# EAGLE design DebugPowerSupplyBoard (EAGLE 7.6.0)
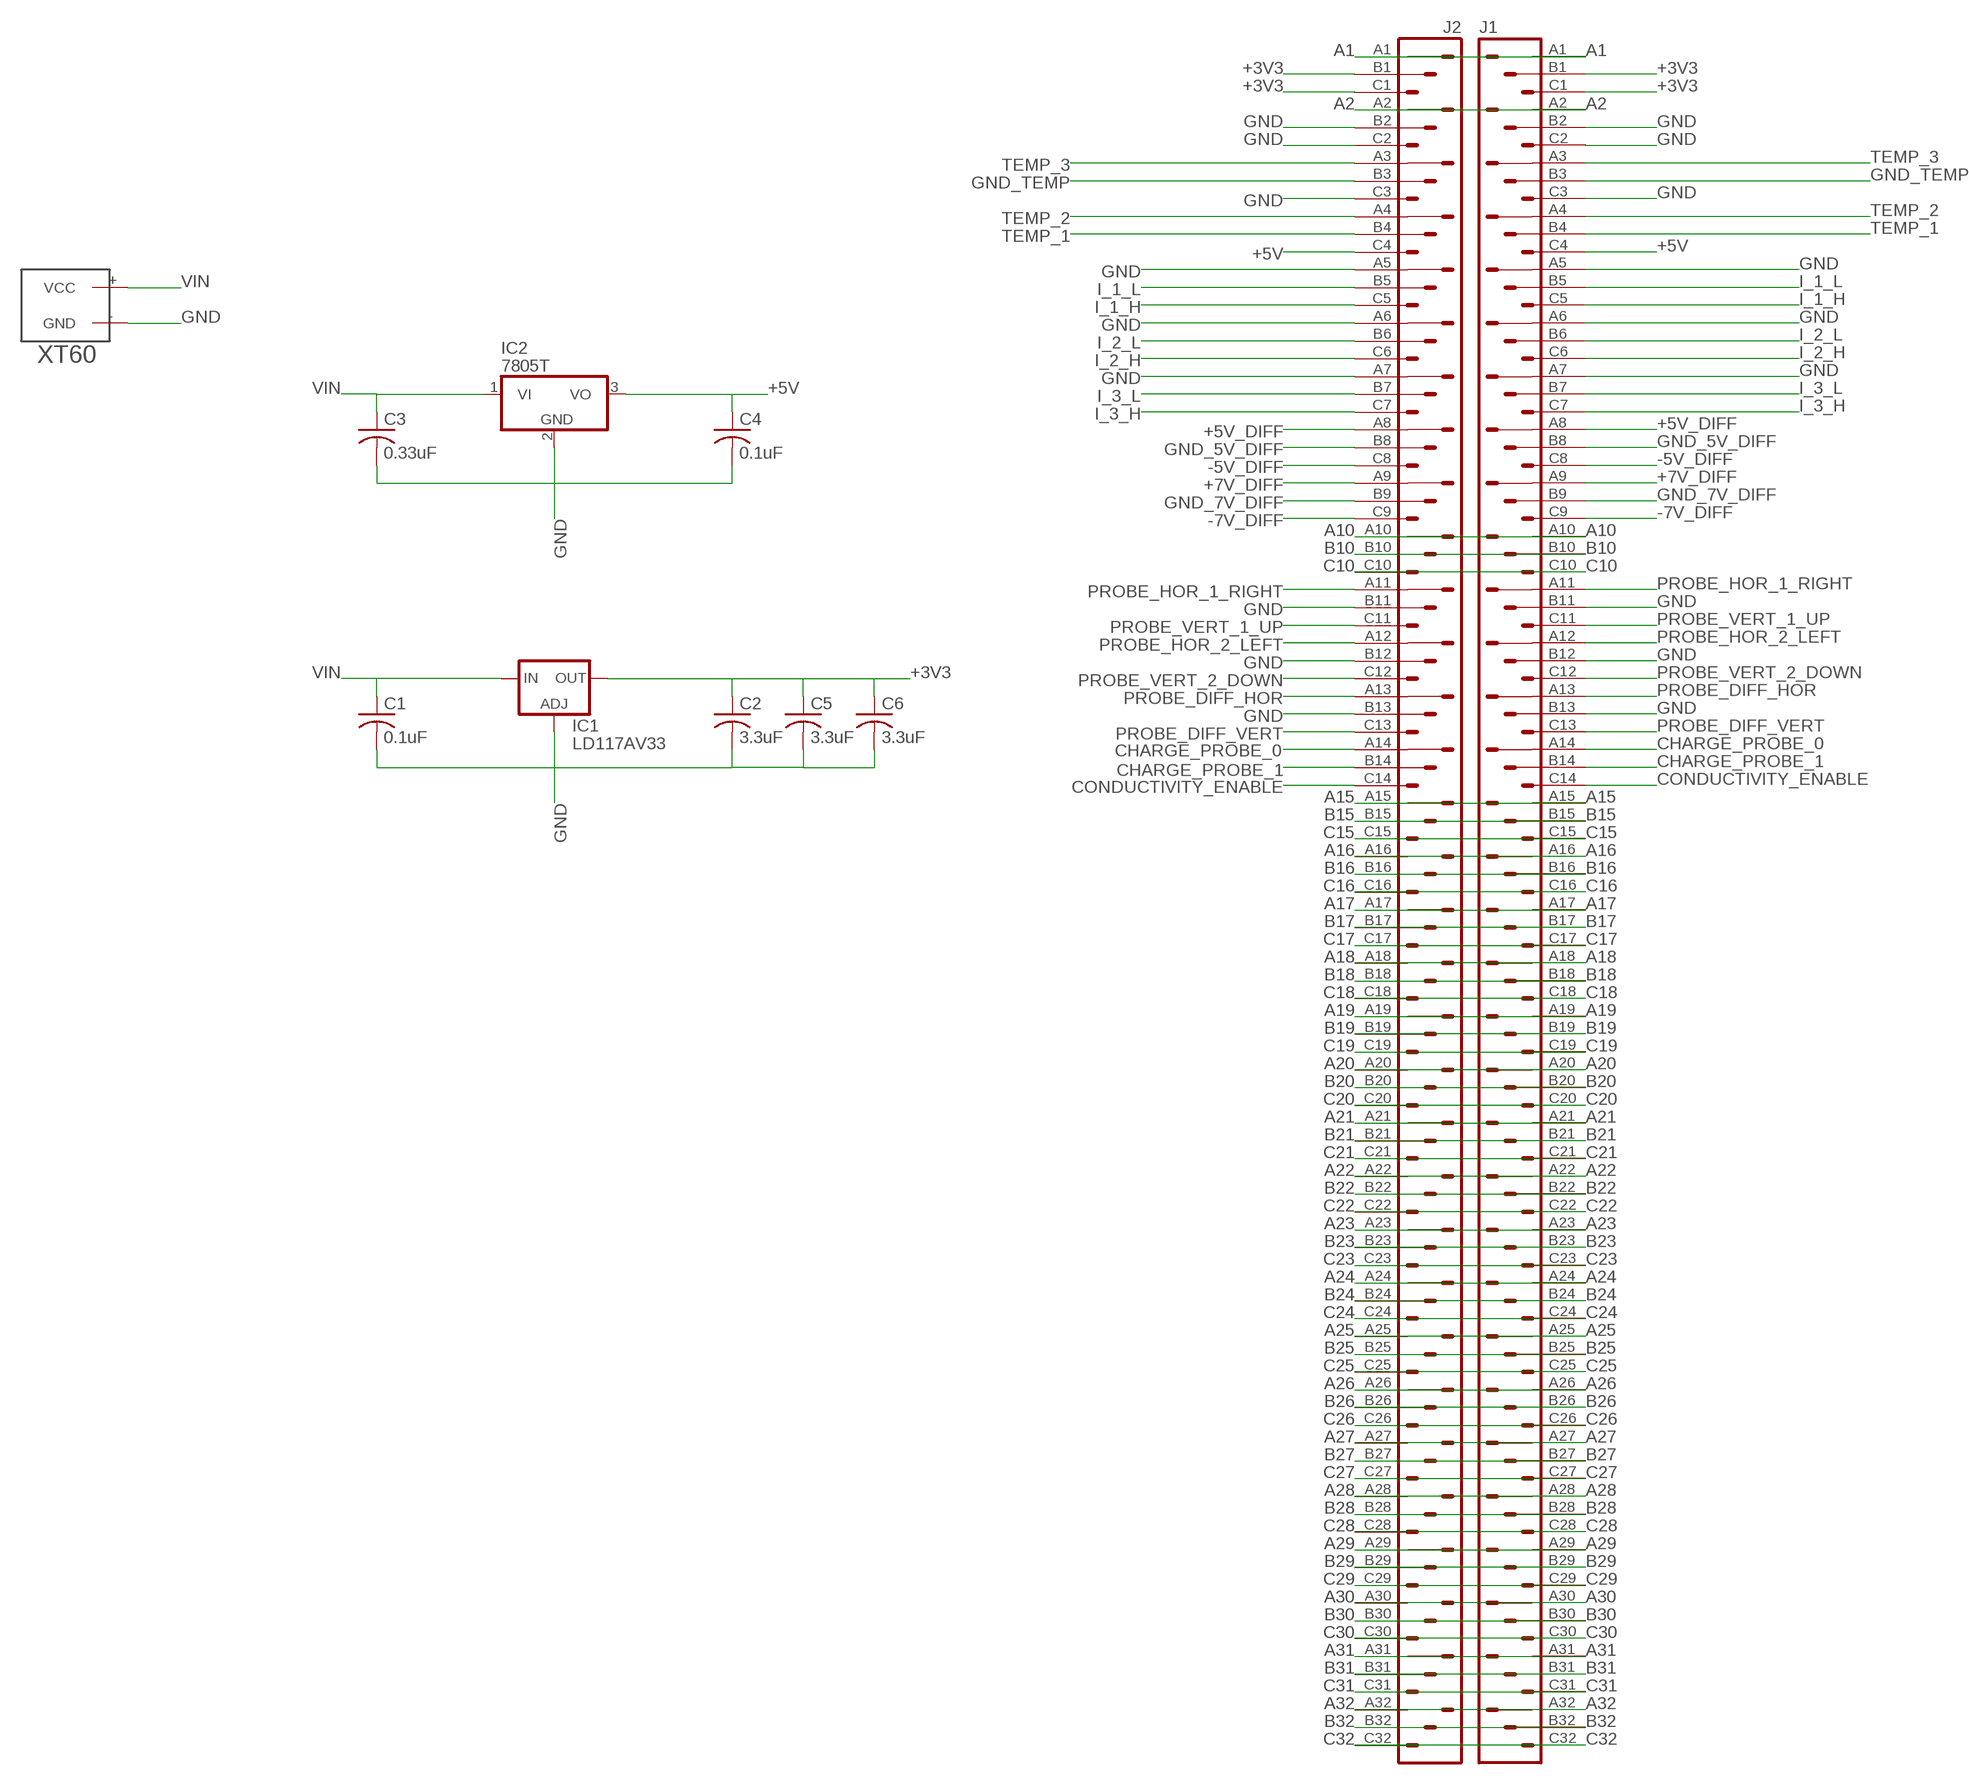
[diagram p0: schematic, sheet 1]

## Parts
C1  0.1uF  C-US050-025X075  [C050-025X075]
C2  3.3uF  C-US050-055X075  [C050-055X075]
C3  0.33uF  C-US050-035X075  [C050-035X075]
C4  0.1uF  C-US050-025X075  [C050-025X075]
C5  3.3uF  C-US050-055X075  [C050-055X075]
C6  3.3uF  C-US050-055X075  [C050-055X075]
IC1  LD117AV33  [TO220L1]
IC2  7805T  [TO220H]
J1  VG96KB  [VG96KB]
J2  VG96KB  [VG96KB]
U$6  XT60  [XT60]

## Nets
+3V3: C2.1 C5.1 C6.1 IC1.2(OUT) J1.B1 J1.C1 J2.B1 J2.C1
+5V [power]: C4.1 IC2.3(VO) J1.C4 J2.C4
+5V_DIFF: J1.A8 J2.A8
+7V_DIFF: J1.A9 J2.A9
-5V_DIFF: J1.C8 J2.C8
-7V_DIFF: J1.C9 J2.C9
A1: J1.A1 J2.A1
A2: J1.A2 J2.A2
A10: J1.A10 J2.A10
A15: J1.A15 J2.A15
A16: J1.A16 J2.A16
A17: J1.A17 J2.A17
A18: J1.A18 J2.A18
A19: J1.A19 J2.A19
A20: J1.A20 J2.A20
A21: J1.A21 J2.A21
A22: J1.A22 J2.A22
A23: J1.A23 J2.A23
A24: J1.A24 J2.A24
A25: J1.A25 J2.A25
A26: J1.A26 J2.A26
A27: J1.A27 J2.A27
A28: J1.A28 J2.A28
A29: J1.A29 J2.A29
A30: J1.A30 J2.A30
A31: J1.A31 J2.A31
A32: J1.A32 J2.A32
B10: J1.B10 J2.B10
B15: J1.B15 J2.B15
B16: J1.B16 J2.B16
B17: J1.B17 J2.B17
B18: J1.B18 J2.B18
B19: J1.B19 J2.B19
B20: J1.B20 J2.B20
B21: J1.B21 J2.B21
B22: J1.B22 J2.B22
B23: J1.B23 J2.B23
B24: J1.B24 J2.B24
B25: J1.B25 J2.B25
B26: J1.B26 J2.B26
B27: J1.B27 J2.B27
B28: J1.B28 J2.B28
B29: J1.B29 J2.B29
B30: J1.B30 J2.B30
B31: J1.B31 J2.B31
B32: J1.B32 J2.B32
C10: J1.C10 J2.C10
C15: J1.C15 J2.C15
C16: J1.C16 J2.C16
C17: J1.C17 J2.C17
C18: J1.C18 J2.C18
C19: J1.C19 J2.C19
C20: J1.C20 J2.C20
C21: J1.C21 J2.C21
C22: J1.C22 J2.C22
C23: J1.C23 J2.C23
C24: J1.C24 J2.C24
C25: J1.C25 J2.C25
C26: J1.C26 J2.C26
C27: J1.C27 J2.C27
C28: J1.C28 J2.C28
C29: J1.C29 J2.C29
C30: J1.C30 J2.C30
C31: J1.C31 J2.C31
C32: J1.C32 J2.C32
CHARGE_PROBE_0: J1.A14 J2.A14
CHARGE_PROBE_1: J1.B14 J2.B14
CONDUCTIVITY_ENABLE: J1.C14 J2.C14
GND [power]: C1.2 C2.2 C3.2 C4.2 C5.2 C6.2 IC1.1(ADJ) IC2.2(GND) J1.A5 J1.A6 J1.A7 J1.B2 J1.B11 J1.B12 J1.B13 J1.C2 J1.C3 J2.A5 J2.A6 J2.A7 J2.B2 J2.B11 J2.B12 J2.B13 J2.C2 J2.C3 U$6.-(GND)
GND_5V_DIFF: J1.B8 J2.B8
GND_7V_DIFF: J1.B9 J2.B9
GND_TEMP: J1.B3 J2.B3
I_1_H: J1.C5 J2.C5
I_1_L: J1.B5 J2.B5
I_2_H: J1.C6 J2.C6
I_2_L: J1.B6 J2.B6
I_3_H: J1.C7 J2.C7
I_3_L: J1.B7 J2.B7
PROBE_DIFF_HOR: J1.A13 J2.A13
PROBE_DIFF_VERT: J1.C13 J2.C13
PROBE_HOR_1_RIGHT: J1.A11 J2.A11
PROBE_HOR_2_LEFT: J1.A12 J2.A12
PROBE_VERT_1_UP: J1.C11 J2.C11
PROBE_VERT_2_DOWN: J1.C12 J2.C12
TEMP_1: J1.B4 J2.B4
TEMP_2: J1.A4 J2.A4
TEMP_3: J1.A3 J2.A3
VIN: C1.1 C3.1 IC1.3(IN) IC2.1(VI) U$6.+(VCC)

## Library data of the parts
C1-C6 = rcl:C-US: CAPACITOR, American symbol
IC1 = v-reg:LD117A?*: Low drop fixed and adjustable positive voltage regulators 1 A Source: http://www.st.com/stonline/products/literature/ds/7194/ld1117axx.pdf
IC2 = linear:78*: Positive VOLTAGE REGULATOR Source: http://cache.national.com/ds/LM/LM78L05.pdf http://www.fairchildsemi.com/ds/LM/LM7805.pdf
J1 = CustomEuroCard:VG96: PCB EUROCARD, 96-pin type C/ABC, 2.54 mm
J2 = 19inch_VG96KB:VG96: PCB EUROCARD, 96-pin type C/ABC, 2.54 mm
U$6 = XT60:XT60: XT60

## Net classes
0 default: width 0.203 mm, drill 0.33 mm, clearance 0.152 mm
1 power: width 0.406 mm, drill 0.33 mm, clearance 0.152 mm

## Board
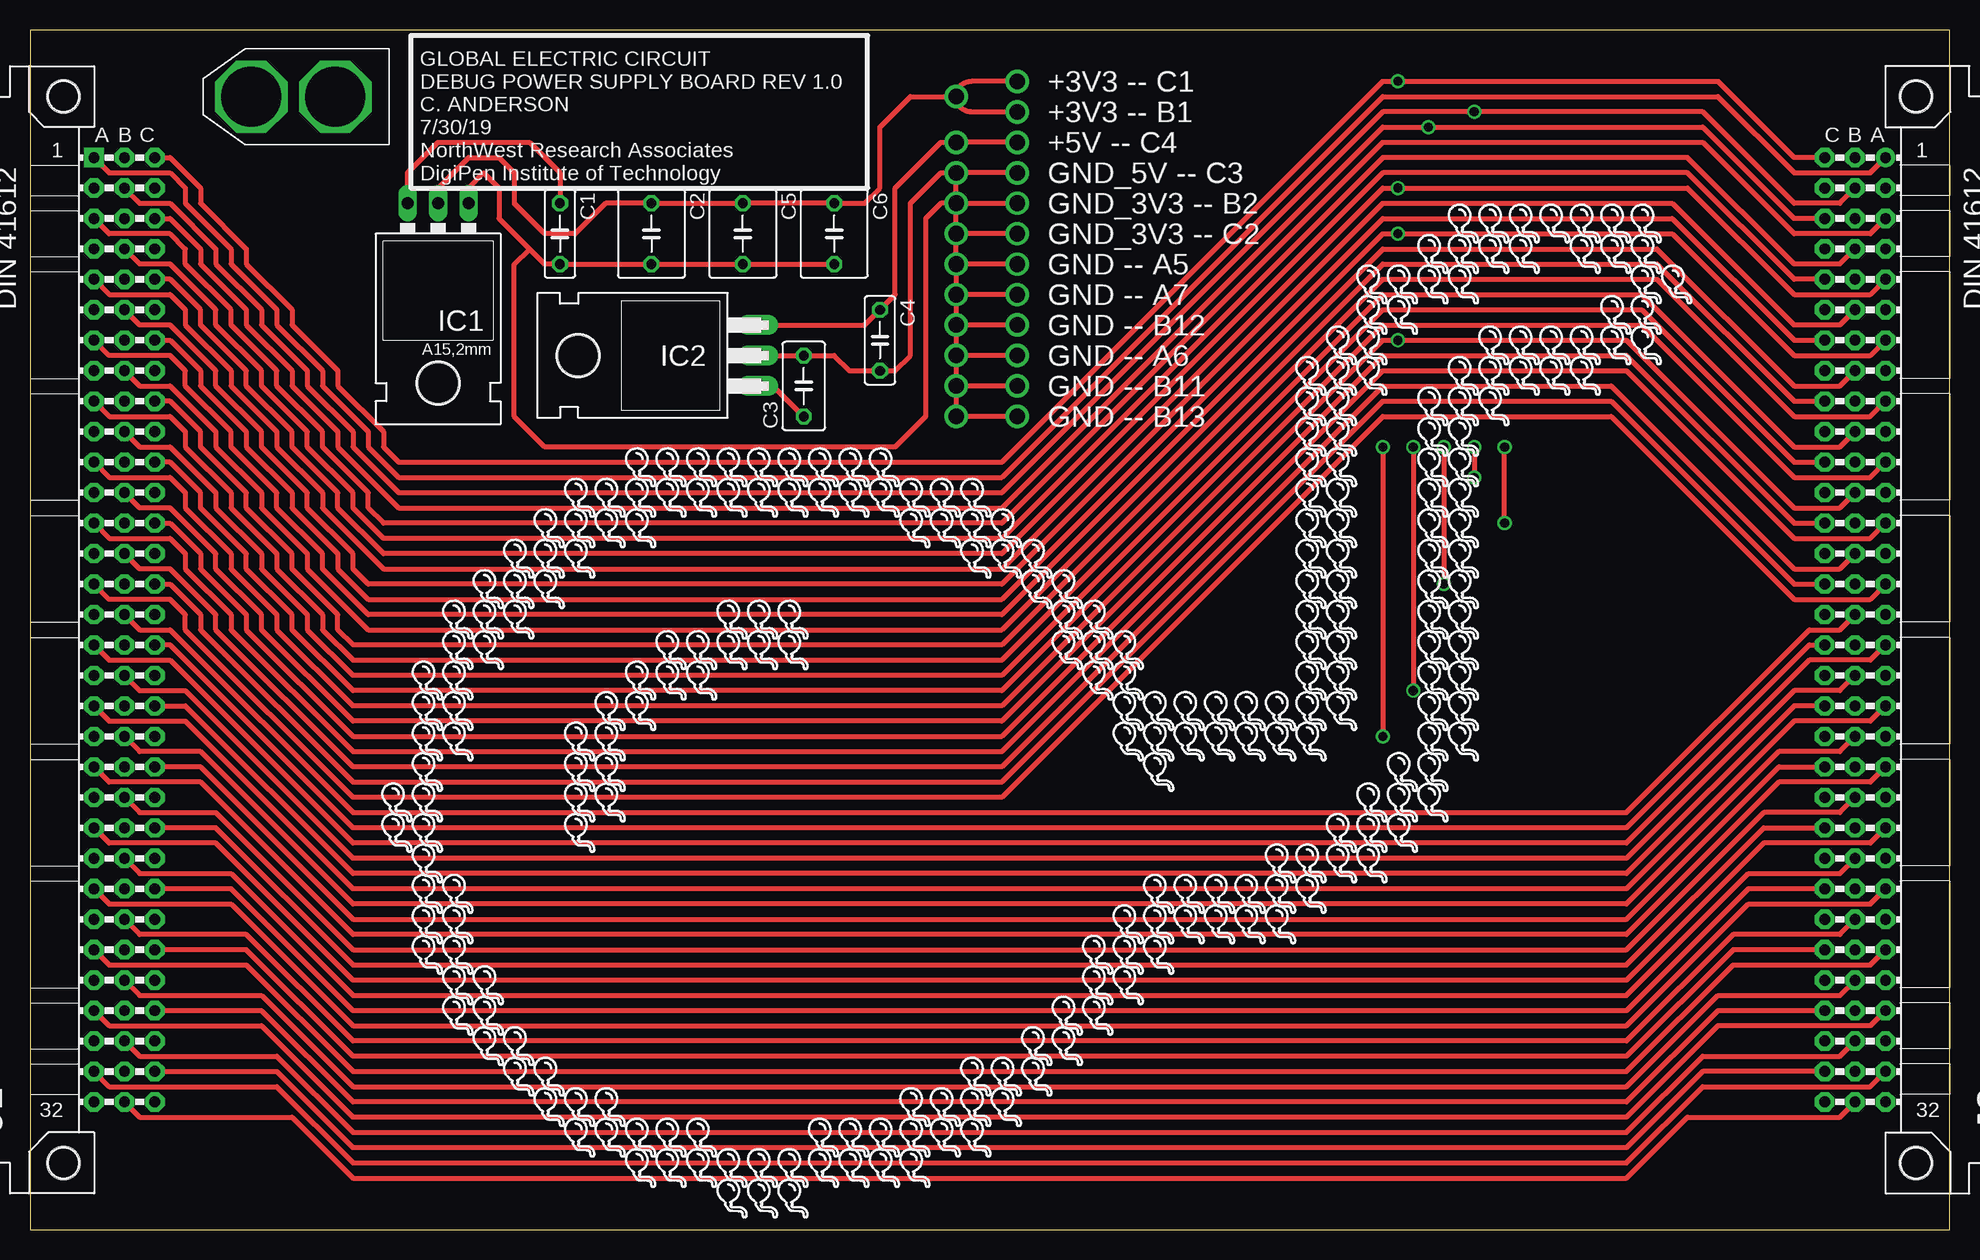
[diagram p1: board, top side]
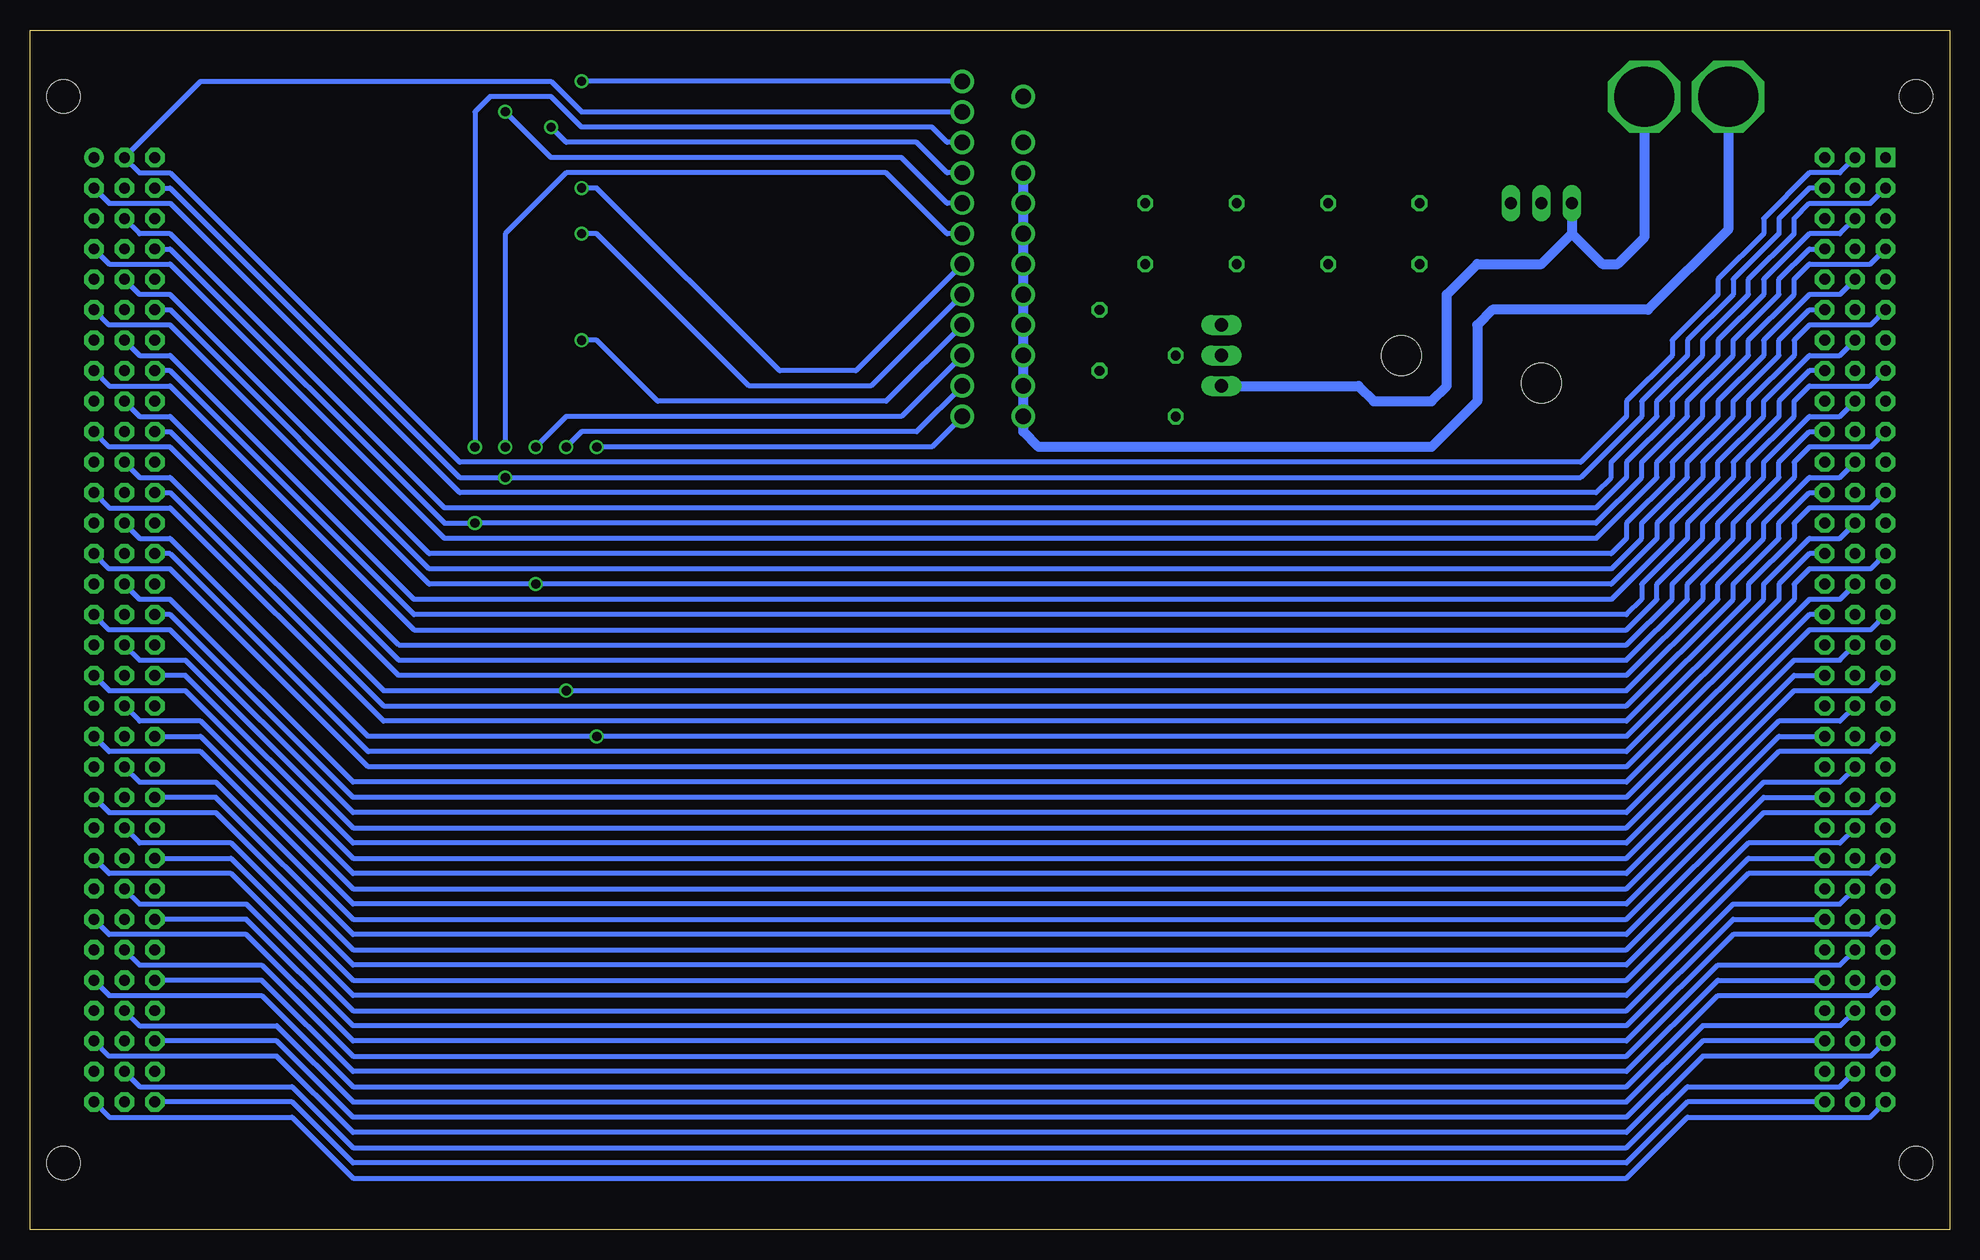
[diagram p2: board, bottom side, seen from below]

Size 160 x 100 mm. Coordinates in mm from the lower left corner, seen from the top.
Copper layers (1*16): Top 0.035mm / dielectric 1.5mm / Bottom 0.035mm
Design rules "default *": minimum track width 6mil, minimum drill 0.3mm, track to track 6mil, track to pad 6mil, pad to pad 6mil, via to via 6mil, smd to smd 6mil, copper to edge 40mil, drill to drill 6mil, minimum pad ring 10mil, minimum via ring 8mil, stop-mask expansion 6mil, vias tented up to drill 0mil, thermal gap 10mil

### Footprints (pad centres in the part's own frame; a part is rotated, then mirrored left to right if it is on the bottom)
C050-025X075 = drill 0.813 octagon: 1 -2.54,0; 2 2.54,0
C050-055X075 = drill 0.813 octagon: 1 -2.54,0; 2 2.54,0
C050-035X075 = drill 0.813 octagon: 1 -2.54,0; 2 2.54,0
TO220L1 = drill 1.016 long: 1 -2.54,-3.81; 2 0,-3.81; 3 2.54,-3.81 | hole 3.302: 0,11.176
TO220H = drill 1.118 long: 1 -2.54,-10.16; 2 0,-10.16; 3 2.54,-10.16 | hole 3.302: 0,4.826
VG96KB = drill 0.914 pad 1.6 square: A1 5.334,39.37 | drill 0.914 pad 1.6 octagon: A2 5.334,36.83; A3 5.334,34.29; A4 5.334,31.75; A5 5.334,29.21; A6 5.334,26.67; A7 5.334,24.13; A8 5.334,21.59; A9 5.334,19.05; A10 5.334,16.51; A11 5.334,13.97; A12 5.334,11.43; A13 5.334,8.89; A14 5.334,6.35; A15 5.334,3.81; A16 5.334,1.27; A17 5.334,-1.27; A18 5.334,-3.81; A19 5.334,-6.35; A20 5.334,-8.89; A21 5.334,-11.43; A22 5.334,-13.97; A23 5.334,-16.51; A24 5.334,-19.05; A25 5.334,-21.59; A26 5.334,-24.13; A27 5.334,-26.67; A28 5.334,-29.21; A29 5.334,-31.75; A30 5.334,-34.29; A31 5.334,-36.83; A32 5.334,-39.37; B1 7.874,39.37; B2 7.874,36.83; B3 7.874,34.29; B4 7.874,31.75; B5 7.874,29.21; B6 7.874,26.67; B7 7.874,24.13; B8 7.874,21.59; B9 7.874,19.05; B10 7.874,16.51; B11 7.874,13.97; B12 7.874,11.43; B13 7.874,8.89; B14 7.874,6.35; B15 7.874,3.81; B16 7.874,1.27; B17 7.874,-1.27; B18 7.874,-3.81; B19 7.874,-6.35; B20 7.874,-8.89; B21 7.874,-11.43; B22 7.874,-13.97; B23 7.874,-16.51; B24 7.874,-19.05; B25 7.874,-21.59; B26 7.874,-24.13; B27 7.874,-26.67; B28 7.874,-29.21; B29 7.874,-31.75; B30 7.874,-34.29; B31 7.874,-36.83; B32 7.874,-39.37; C1 10.414,39.37; C2 10.414,36.83; C3 10.414,34.29; C4 10.414,31.75; C5 10.414,29.21; C6 10.414,26.67; C7 10.414,24.13; C8 10.414,21.59; C9 10.414,19.05; C10 10.414,16.51; C11 10.414,13.97; C12 10.414,11.43; C13 10.414,8.89; C14 10.414,6.35; C15 10.414,3.81; C16 10.414,1.27; C17 10.414,-1.27; C18 10.414,-3.81; C19 10.414,-6.35; C20 10.414,-8.89; C21 10.414,-11.43; C22 10.414,-13.97; C23 10.414,-16.51; C24 10.414,-19.05; C25 10.414,-21.59; C26 10.414,-24.13; C27 10.414,-26.67; C28 10.414,-29.21; C29 10.414,-31.75; C30 10.414,-34.29; C31 10.414,-36.83; C32 10.414,-39.37 | hole 2.794: 2.794,44.45; 2.794,-44.45
VG96KB' = drill 0.914 pad 1.6: A1 154.666,39.37 | drill 0.914 pad 1.6 octagon: A2 154.666,36.83; A3 154.666,34.29; A4 154.666,31.75; A5 154.666,29.21; A6 154.666,26.67; A7 154.666,24.13; A8 154.666,21.59; A9 154.666,19.05; A10 154.666,16.51; A11 154.666,13.97; A12 154.666,11.43; A13 154.666,8.89; A14 154.666,6.35; A15 154.666,3.81; A16 154.666,1.27; A17 154.666,-1.27; A18 154.666,-3.81; A19 154.666,-6.35; A20 154.666,-8.89; A21 154.666,-11.43; A22 154.666,-13.97; A23 154.666,-16.51; A24 154.666,-19.05; A25 154.666,-21.59; A26 154.666,-24.13; A27 154.666,-26.67; A28 154.666,-29.21; A29 154.666,-31.75; A30 154.666,-34.29; A31 154.666,-36.83; A32 154.666,-39.37; B1 152.126,39.37; B2 152.126,36.83; B3 152.126,34.29; B4 152.126,31.75; B5 152.126,29.21; B6 152.126,26.67; B7 152.126,24.13; B8 152.126,21.59; B9 152.126,19.05; B10 152.126,16.51; B11 152.126,13.97; B12 152.126,11.43; B13 152.126,8.89; B14 152.126,6.35; B15 152.126,3.81; B16 152.126,1.27; B17 152.126,-1.27; B18 152.126,-3.81; B19 152.126,-6.35; B20 152.126,-8.89; B21 152.126,-11.43; B22 152.126,-13.97; B23 152.126,-16.51; B24 152.126,-19.05; B25 152.126,-21.59; B26 152.126,-24.13; B27 152.126,-26.67; B28 152.126,-29.21; B29 152.126,-31.75; B30 152.126,-34.29; B31 152.126,-36.83; B32 152.126,-39.37; C1 149.586,39.37; C2 149.586,36.83; C3 149.586,34.29; C4 149.586,31.75; C5 149.586,29.21; C6 149.586,26.67; C7 149.586,24.13; C8 149.586,21.59; C9 149.586,19.05; C10 149.586,16.51; C11 149.586,13.97; C12 149.586,11.43; C13 149.586,8.89; C14 149.586,6.35; C15 149.586,3.81; C16 149.586,1.27; C17 149.586,-1.27; C18 149.586,-3.81; C19 149.586,-6.35; C20 149.586,-8.89; C21 149.586,-11.43; C22 149.586,-13.97; C23 149.586,-16.51; C24 149.586,-19.05; C25 149.586,-21.59; C26 149.586,-24.13; C27 149.586,-26.67; C28 149.586,-29.21; C29 149.586,-31.75; C30 149.586,-34.29; C31 149.586,-36.83; C32 149.586,-39.37 | hole 2.794: 157.206,44.45; 157.206,-44.45
XT60 = drill 5 octagon: + 4.5,0; - 11.5,0

### Placement (x,y rotation side)
C1  44.18,83.02 270 top
C2  51.8,83.02 270 top
C3  64.5,70.32 90 top
C4  70.85,74.13 270 top
C5  59.42,83.02 270 top
C6  67.04,83.02 270 top
IC1  34.02,81.75 180 top
IC2  50.53,72.86 90 top
J1  0,50 0 top
J2  [VG96KB']  0,50 0 top
U$6  29.95,94.45 180 top
U$21  [BALLOON]  58.15,3.01 0 top
U$273  [BALLOON]  60.69,3.01 0 top
U$274  [BALLOON]  63.23,3.01 0 top
U$275  [BALLOON]  58.15,5.55 0 top
U$276  [BALLOON]  55.61,5.55 0 top
U$277  [BALLOON]  53.07,5.55 0 top
U$278  [BALLOON]  50.53,5.55 0 top
U$279  [BALLOON]  60.69,5.55 0 top
U$280  [BALLOON]  63.23,5.55 0 top
U$281  [BALLOON]  65.77,5.55 0 top
U$282  [BALLOON]  68.31,5.55 0 top
U$283  [BALLOON]  70.85,5.55 0 top
U$284  [BALLOON]  55.61,8.09 0 top
U$285  [BALLOON]  53.07,8.09 0 top
U$286  [BALLOON]  50.53,8.09 0 top
U$287  [BALLOON]  47.99,8.09 0 top
U$288  [BALLOON]  45.45,8.09 0 top
U$289  [BALLOON]  70.85,8.09 0 top
U$290  [BALLOON]  73.39,8.09 0 top
U$291  [BALLOON]  75.93,8.09 0 top
U$292  [BALLOON]  68.31,8.09 0 top
U$293  [BALLOON]  65.77,8.09 0 top
U$294  [BALLOON]  78.47,8.09 0 top
U$295  [BALLOON]  73.39,5.55 0 top
U$296  [BALLOON]  78.47,10.63 0 top
U$297  [BALLOON]  75.93,10.63 0 top
U$298  [BALLOON]  42.91,10.63 0 top
U$299  [BALLOON]  40.37,13.17 0 top
U$300  [BALLOON]  45.45,10.63 0 top
U$301  [BALLOON]  47.99,10.63 0 top
U$302  [BALLOON]  42.91,13.17 0 top
U$303  [BALLOON]  37.83,15.71 0 top
U$304  [BALLOON]  40.37,15.71 0 top
U$305  [BALLOON]  35.29,18.25 0 top
U$306  [BALLOON]  35.29,20.79 0 top
U$307  [BALLOON]  37.83,18.25 0 top
U$308  [BALLOON]  37.83,20.79 0 top
U$309  [BALLOON]  32.75,23.33 0 top
U$310  [BALLOON]  32.75,25.87 0 top
U$311  [BALLOON]  32.75,28.41 0 top
U$312  [BALLOON]  35.29,28.41 0 top
U$313  [BALLOON]  35.29,25.87 0 top
U$314  [BALLOON]  35.29,23.33 0 top
U$315  [BALLOON]  32.75,30.95 0 top
U$316  [BALLOON]  32.75,33.49 0 top
U$317  [BALLOON]  30.21,33.49 0 top
U$318  [BALLOON]  30.21,36.03 0 top
U$319  [BALLOON]  32.75,36.03 0 top
U$320  [BALLOON]  32.75,38.57 0 top
U$321  [BALLOON]  45.45,33.49 0 top
U$322  [BALLOON]  45.45,36.03 0 top
U$323  [BALLOON]  47.99,36.03 0 top
U$324  [BALLOON]  45.45,38.57 0 top
U$325  [BALLOON]  45.45,41.11 0 top
U$326  [BALLOON]  47.99,38.57 0 top
U$327  [BALLOON]  47.99,41.11 0 top
U$328  [BALLOON]  47.99,43.65 0 top
U$329  [BALLOON]  50.53,43.65 0 top
U$330  [BALLOON]  50.53,46.19 0 top
U$331  [BALLOON]  53.07,46.19 0 top
U$332  [BALLOON]  55.61,46.19 0 top
U$333  [BALLOON]  53.07,48.73 0 top
U$334  [BALLOON]  55.61,48.73 0 top
U$335  [BALLOON]  58.15,48.73 0 top
U$336  [BALLOON]  60.69,48.73 0 top
U$337  [BALLOON]  63.23,48.73 0 top
U$338  [BALLOON]  63.23,51.27 0 top
U$339  [BALLOON]  60.69,51.27 0 top
U$340  [BALLOON]  58.15,51.27 0 top
U$341  [BALLOON]  32.75,41.11 0 top
U$342  [BALLOON]  35.29,41.11 0 top
U$343  [BALLOON]  35.29,43.65 0 top
U$344  [BALLOON]  35.29,46.19 0 top
U$345  [BALLOON]  32.75,46.19 0 top
U$346  [BALLOON]  32.75,43.65 0 top
U$347  [BALLOON]  35.29,48.73 0 top
U$348  [BALLOON]  35.29,51.27 0 top
U$349  [BALLOON]  37.83,48.73 0 top
U$350  [BALLOON]  37.83,51.27 0 top
U$351  [BALLOON]  37.83,53.81 0 top
U$352  [BALLOON]  40.37,56.35 0 top
U$353  [BALLOON]  42.91,58.89 0 top
U$354  [BALLOON]  45.45,61.43 0 top
U$355  [BALLOON]  47.99,61.43 0 top
U$356  [BALLOON]  45.45,58.89 0 top
U$357  [BALLOON]  42.91,56.35 0 top
U$358  [BALLOON]  40.37,53.81 0 top
U$359  [BALLOON]  40.37,51.27 0 top
U$360  [BALLOON]  42.91,53.81 0 top
U$361  [BALLOON]  45.45,56.35 0 top
U$362  [BALLOON]  47.99,58.89 0 top
U$363  [BALLOON]  50.53,61.43 0 top
U$364  [BALLOON]  50.53,58.89 0 top
U$365  [BALLOON]  50.53,63.97 0 top
U$366  [BALLOON]  53.07,61.43 0 top
U$367  [BALLOON]  53.07,63.97 0 top
U$368  [BALLOON]  55.61,61.43 0 top
U$369  [BALLOON]  58.15,61.43 0 top
U$370  [BALLOON]  60.69,61.43 0 top
U$371  [BALLOON]  63.23,61.43 0 top
U$372  [BALLOON]  60.69,61.43 0 top
U$373  [BALLOON]  65.77,61.43 0 top
U$374  [BALLOON]  68.31,61.43 0 top
U$375  [BALLOON]  70.85,61.43 0 top
U$376  [BALLOON]  55.61,63.97 0 top
U$377  [BALLOON]  58.15,63.97 0 top
U$378  [BALLOON]  60.69,63.97 0 top
U$379  [BALLOON]  63.23,63.97 0 top
U$380  [BALLOON]  65.77,63.97 0 top
U$381  [BALLOON]  68.31,63.97 0 top
U$382  [BALLOON]  70.85,63.97 0 top
U$383  [BALLOON]  73.39,61.43 0 top
U$384  [BALLOON]  73.39,58.89 0 top
U$385  [BALLOON]  75.93,58.89 0 top
U$386  [BALLOON]  78.47,58.89 0 top
U$387  [BALLOON]  78.47,61.43 0 top
U$388  [BALLOON]  75.93,61.43 0 top
U$389  [BALLOON]  78.47,56.35 0 top
U$390  [BALLOON]  81.01,56.35 0 top
U$391  [BALLOON]  81.01,58.89 0 top
U$392  [BALLOON]  83.55,56.35 0 top
U$393  [BALLOON]  83.55,53.81 0 top
U$394  [BALLOON]  86.09,53.81 0 top
U$395  [BALLOON]  86.09,51.27 0 top
U$396  [BALLOON]  86.09,48.73 0 top
U$397  [BALLOON]  88.63,51.27 0 top
U$398  [BALLOON]  88.63,48.73 0 top
U$399  [BALLOON]  88.63,46.19 0 top
U$400  [BALLOON]  91.17,48.73 0 top
U$401  [BALLOON]  91.17,46.19 0 top
U$402  [BALLOON]  91.17,43.65 0 top
U$403  [BALLOON]  91.17,41.11 0 top
U$404  [BALLOON]  93.71,38.57 0 top
U$405  [BALLOON]  93.71,41.11 0 top
U$406  [BALLOON]  93.71,43.65 0 top
U$407  [BALLOON]  96.25,41.11 0 top
U$408  [BALLOON]  98.79,41.11 0 top
U$409  [BALLOON]  101.33,41.11 0 top
U$410  [BALLOON]  103.87,41.11 0 top
U$411  [BALLOON]  106.41,41.11 0 top
U$412  [BALLOON]  106.41,43.65 0 top
U$413  [BALLOON]  103.87,43.65 0 top
U$414  [BALLOON]  101.33,43.65 0 top
U$415  [BALLOON]  98.79,43.65 0 top
U$416  [BALLOON]  96.25,43.65 0 top
U$417  [BALLOON]  108.95,43.65 0 top
U$418  [BALLOON]  108.95,46.19 0 top
U$419  [BALLOON]  108.95,48.73 0 top
U$420  [BALLOON]  108.95,51.27 0 top
U$421  [BALLOON]  108.95,53.81 0 top
U$422  [BALLOON]  108.95,56.35 0 top
U$423  [BALLOON]  108.95,58.89 0 top
U$424  [BALLOON]  108.95,61.43 0 top
U$425  [BALLOON]  108.95,63.97 0 top
U$426  [BALLOON]  108.95,66.51 0 top
U$427  [BALLOON]  108.95,69.05 0 top
U$428  [BALLOON]  108.95,71.59 0 top
U$429  [BALLOON]  106.41,71.59 0 top
U$430  [BALLOON]  106.41,69.05 0 top
U$431  [BALLOON]  106.41,66.51 0 top
U$432  [BALLOON]  106.41,66.51 0 top
U$433  [BALLOON]  106.41,63.97 0 top
U$434  [BALLOON]  106.41,61.43 0 top
U$435  [BALLOON]  106.41,58.89 0 top
U$436  [BALLOON]  106.41,56.35 0 top
U$437  [BALLOON]  106.41,53.81 0 top
U$438  [BALLOON]  106.41,51.27 0 top
U$439  [BALLOON]  106.41,48.73 0 top
U$440  [BALLOON]  106.41,46.19 0 top
U$441  [BALLOON]  86.09,15.71 0 top
U$442  [BALLOON]  86.09,18.25 0 top
U$443  [BALLOON]  88.63,18.25 0 top
U$444  [BALLOON]  88.63,20.79 0 top
U$445  [BALLOON]  91.17,20.79 0 top
U$446  [BALLOON]  91.17,23.33 0 top
U$447  [BALLOON]  88.63,23.33 0 top
U$448  [BALLOON]  93.71,25.87 0 top
U$449  [BALLOON]  93.71,23.33 0 top
U$450  [BALLOON]  91.17,25.87 0 top
U$451  [BALLOON]  96.25,28.41 0 top
U$452  [BALLOON]  96.25,25.87 0 top
U$453  [BALLOON]  93.71,28.41 0 top
U$454  [BALLOON]  98.79,25.87 0 top
U$455  [BALLOON]  101.33,25.87 0 top
U$456  [BALLOON]  103.87,25.87 0 top
U$457  [BALLOON]  103.87,28.41 0 top
U$458  [BALLOON]  101.33,28.41 0 top
U$459  [BALLOON]  98.79,28.41 0 top
U$460  [BALLOON]  73.39,10.63 0 top
U$461  [BALLOON]  81.01,13.17 0 top
U$462  [BALLOON]  81.01,10.63 0 top
U$463  [BALLOON]  78.47,13.17 0 top
U$464  [BALLOON]  83.55,13.17 0 top
U$465  [BALLOON]  83.55,15.71 0 top
U$466  [BALLOON]  106.41,28.41 0 top
U$467  [BALLOON]  106.41,30.95 0 top
U$468  [BALLOON]  103.87,30.95 0 top
U$469  [BALLOON]  108.95,30.95 0 top
U$470  [BALLOON]  108.95,33.49 0 top
U$471  [BALLOON]  111.49,33.49 0 top
U$472  [BALLOON]  111.49,30.95 0 top
U$473  [BALLOON]  114.03,36.03 0 top
U$474  [BALLOON]  114.03,33.49 0 top
U$475  [BALLOON]  111.49,36.03 0 top
U$476  [BALLOON]  116.57,36.03 0 top
U$477  [BALLOON]  116.57,38.57 0 top
U$478  [BALLOON]  114.03,38.57 0 top
U$479  [BALLOON]  116.57,41.11 0 top
U$480  [BALLOON]  119.11,41.11 0 top
U$481  [BALLOON]  116.57,43.65 0 top
U$482  [BALLOON]  116.57,46.19 0 top
U$483  [BALLOON]  116.57,48.73 0 top
U$484  [BALLOON]  116.57,51.27 0 top
U$485  [BALLOON]  116.57,53.81 0 top
U$486  [BALLOON]  116.57,56.35 0 top
U$487  [BALLOON]  116.57,58.89 0 top
U$488  [BALLOON]  116.57,61.43 0 top
U$489  [BALLOON]  116.57,63.97 0 top
U$490  [BALLOON]  116.57,66.51 0 top
U$491  [BALLOON]  116.57,69.05 0 top
U$492  [BALLOON]  119.11,69.05 0 top
U$493  [BALLOON]  119.11,66.51 0 top
U$494  [BALLOON]  119.11,63.97 0 top
U$495  [BALLOON]  119.11,61.43 0 top
U$496  [BALLOON]  119.11,58.89 0 top
U$497  [BALLOON]  119.11,56.35 0 top
U$498  [BALLOON]  119.11,53.81 0 top
U$499  [BALLOON]  119.11,51.27 0 top
U$500  [BALLOON]  119.11,48.73 0 top
U$501  [BALLOON]  119.11,43.65 0 top
U$502  [BALLOON]  119.11,46.19 0 top
U$503  [BALLOON]  119.11,71.59 0 top
U$504  [BALLOON]  121.65,71.59 0 top
U$505  [BALLOON]  121.65,69.05 0 top
U$506  [BALLOON]  121.65,74.13 0 top
U$507  [BALLOON]  124.19,71.59 0 top
U$508  [BALLOON]  126.73,71.59 0 top
U$509  [BALLOON]  129.27,71.59 0 top
U$510  [BALLOON]  129.27,74.13 0 top
U$511  [BALLOON]  126.73,74.13 0 top
U$512  [BALLOON]  124.19,74.13 0 top
U$513  [BALLOON]  131.81,74.13 0 top
U$514  [BALLOON]  131.81,76.67 0 top
U$515  [BALLOON]  134.35,76.67 0 top
U$516  [BALLOON]  134.35,74.13 0 top
U$517  [BALLOON]  134.35,79.21 0 top
U$518  [BALLOON]  136.89,79.21 0 top
U$519  [BALLOON]  134.35,81.75 0 top
U$520  [BALLOON]  131.81,81.75 0 top
U$521  [BALLOON]  129.27,81.75 0 top
U$522  [BALLOON]  129.27,84.29 0 top
U$523  [BALLOON]  131.81,84.29 0 top
U$524  [BALLOON]  134.35,84.29 0 top
U$525  [BALLOON]  126.73,84.29 0 top
U$526  [BALLOON]  124.19,84.29 0 top
U$527  [BALLOON]  124.19,81.75 0 top
U$528  [BALLOON]  121.65,81.75 0 top
U$529  [BALLOON]  119.11,81.75 0 top
U$530  [BALLOON]  119.11,84.29 0 top
U$531  [BALLOON]  121.65,84.29 0 top
U$532  [BALLOON]  119.11,79.21 0 top
U$533  [BALLOON]  116.57,79.21 0 top
U$534  [BALLOON]  116.57,81.75 0 top
U$535  [BALLOON]  111.49,74.13 0 top
U$536  [BALLOON]  111.49,71.59 0 top
U$537  [BALLOON]  108.95,74.13 0 top
U$538  [BALLOON]  114.03,76.67 0 top
U$539  [BALLOON]  114.03,79.21 0 top
U$540  [BALLOON]  111.49,79.21 0 top
U$541  [BALLOON]  111.49,76.67 0 top

### Tracks (layer width: path | path; a pad name or v marks a point on that pad's centre or on a via)
+3V3  (via drill 0.76, 1.3)
  Top 0.406: J1.C1 11.68,89.37 14.22,86.83 14.22,85.56 18.03,81.75 18.03,80.48 21.84,76.67 21.84,75.4 25.65,71.59 25.65,70.32 29.46,66.51 29.46,65.24 30.73,63.97 81.01,63.97 112.76,95.72 v114.03,95.72 140.7,95.72 147.05,89.37 J2.C1 | v82.28,93.18 78.47,93.18 arc-90 v77.2,94.45 | v82.28,95.72 78.47,95.72 arc90 v77.2,94.45 | IC1.2 34.02,86.83 36.56,89.37 39.1,89.37 40.37,88.1 40.37,85.56 42.91,83.02 45.45,83.02 47.99,85.56 C2.1 C5.1 C6.1 69.58,85.56 70.85,86.83 70.85,91.91 73.39,94.45 v77.2,94.45
  Bottom 0.406: J1.B1 9.14,88.1 11.68,88.1 15.49,84.29 15.49,83.02 19.3,79.21 19.3,77.94 23.11,74.13 23.11,72.86 26.92,69.05 26.92,67.78 30.73,63.97 124.19,63.97 148.32,88.1 150.86,88.1 J2.B1 145.78,95.72 116.57,95.72 114.03,93.18 v82.28,93.18 | v82.28,95.72 v114.03,95.72
+5V  (via drill 0.76, 1.3)
  Top 0.406: v122.92,58.89 v122.92,65.24 | v82.28,90.64 v77.2,90.64 75.93,90.64 72.12,86.83 72.12,77.94 C4.1 69.58,75.4 IC2.3
  Bottom 0.406: J1.C4 11.68,81.75 14.22,79.21 14.22,77.94 18.03,74.13 18.03,72.86 21.84,69.05 21.84,67.78 25.65,63.97 25.65,62.7 29.46,58.89 v122.92,58.89 125.46,58.89 148.32,81.75 J2.C4 | v82.28,90.64 83.55,90.64 84.82,91.91 114.03,91.91 116.57,94.45 121.65,94.45 122.92,93.18 v122.92,65.24
+5V_DIFF
  Bottom 0.406: J2.A8 153.4,70.32 148.32,70.32 128,50 26.92,50 24.38,52.54 24.38,53.81 20.57,57.62 20.57,58.89 16.76,62.7 16.76,63.97 12.95,67.78 12.95,69.05 11.68,70.32 6.6,70.32 J1.A8
+7V_DIFF
  Top 0.406: J1.A9 6.6,67.78 11.68,67.78 12.95,66.51 12.95,65.24 16.76,61.43 16.76,60.16 20.57,56.35 20.57,55.08 24.38,51.27 24.38,50 26.92,47.46 81.01,47.46 112.76,79.21 135.62,79.21 147.05,67.78 153.4,67.78 J2.A9
-5V_DIFF
  Bottom 0.406: J1.C8 11.68,71.59 14.22,69.05 14.22,67.78 18.03,63.97 18.03,62.7 21.84,58.89 21.84,57.62 25.65,53.81 25.65,52.54 26.92,51.27 128,51.27 148.32,71.59 J2.C8
-7V_DIFF
  Top 0.406: J1.C9 11.68,69.05 14.22,66.51 14.22,65.24 18.03,61.43 18.03,60.16 21.84,56.35 21.84,55.08 25.65,51.27 25.65,50 26.92,48.73 81.01,48.73 112.76,80.48 135.62,80.48 147.05,69.05 J2.C9
A1
  Top 0.406: J2.A1 153.4,88.1 147.05,88.1 140.7,94.45 112.76,94.45 81.01,62.7 30.73,62.7 28.19,65.24 28.19,66.51 24.38,70.32 24.38,71.59 20.57,75.4 20.57,76.67 16.76,80.48 16.76,81.75 12.95,85.56 12.95,86.83 11.68,88.1 6.6,88.1 J1.A1
A2
  Bottom 0.406: J2.A2 153.4,85.56 148.32,85.56 124.19,61.43 29.46,61.43 28.19,62.7 28.19,63.97 24.38,67.78 24.38,69.05 20.57,72.86 20.57,74.13 16.76,77.94 16.76,79.21 12.95,83.02 12.95,84.29 11.68,85.56 6.6,85.56 J1.A2
A10
  Bottom 0.406: J1.A10 6.6,65.24 11.68,65.24 12.95,63.97 12.95,62.7 16.76,58.89 16.76,57.62 20.57,53.81 20.57,52.54 26.92,46.19 129.27,46.19 148.32,65.24 153.4,65.24 J2.A10
A15
  Top 0.406: J2.A15 153.4,52.54 147.05,52.54 131.81,67.78 112.76,67.78 81.01,36.03 26.92,36.03 12.95,50 12.95,51.27 11.68,52.54 6.6,52.54 J1.A15
A16
  Bottom 0.406: J1.A16 6.6,50 11.68,50 26.92,34.76 133.08,34.76 148.32,50 153.4,50 J2.A16
A17
  Top 0.406: J2.A17 153.4,47.46 148.32,47.46 133.08,32.22 26.92,32.22 11.68,47.46 6.6,47.46 J1.A17
A18
  Bottom 0.406: J2.A18 153.4,44.92 147.05,44.92 133.08,30.95 26.92,30.95 12.95,44.92 6.6,44.92 J1.A18
A19
  Top 0.406: J2.A19 153.4,42.38 147.05,42.38 133.08,28.41 26.92,28.41 12.95,42.38 6.6,42.38 J1.A19
A20
  Bottom 0.406: J2.A20 153.4,39.84 145.78,39.84 133.08,27.14 26.92,27.14 14.22,39.84 6.6,39.84 J1.A20
A21
  Top 0.406: J2.A21 153.4,37.3 145.78,37.3 133.08,24.6 26.92,24.6 14.22,37.3 6.6,37.3 J1.A21
A22
  Bottom 0.406: J2.A22 153.4,34.76 144.51,34.76 133.08,23.33 26.92,23.33 15.49,34.76 6.6,34.76 J1.A22
A23
  Top 0.406: J2.A23 153.4,32.22 144.51,32.22 133.08,20.79 26.92,20.79 15.49,32.22 6.6,32.22 J1.A23
A24
  Bottom 0.406: J2.A24 153.4,29.68 143.24,29.68 133.08,19.52 26.92,19.52 16.76,29.68 6.6,29.68 J1.A24
A25
  Top 0.406: J2.A25 153.4,27.14 143.24,27.14 133.08,16.98 26.92,16.98 16.76,27.14 6.6,27.14 J1.A25
A26
  Bottom 0.406: J2.A26 153.4,24.6 141.97,24.6 133.08,15.71 26.92,15.71 18.03,24.6 6.6,24.6 J1.A26
A27
  Top 0.406: J2.A27 153.4,22.06 141.97,22.06 133.08,13.17 26.92,13.17 18.03,22.06 6.6,22.06 J1.A27
A28
  Bottom 0.406: J2.A28 153.4,19.52 140.7,19.52 133.08,11.9 26.92,11.9 19.3,19.52 6.6,19.52 J1.A28
A29
  Top 0.406: J2.A29 153.4,16.98 140.7,16.98 133.08,9.36 26.92,9.36 19.3,16.98 6.6,16.98 J1.A29
A30
  Bottom 0.406: J1.A30 6.6,14.44 20.57,14.44 26.92,8.09 133.08,8.09 139.43,14.44 153.4,14.44 J2.A30
A31
  Top 0.406: J2.A31 153.4,11.9 139.43,11.9 133.08,5.55 26.92,5.55 20.57,11.9 6.6,11.9 J1.A31
A32
  Bottom 0.406: J2.A32 153.4,9.36 138.16,9.36 133.08,4.28 26.92,4.28 21.84,9.36 6.6,9.36 J1.A32
B10
  Top 0.406: J1.B10 9.14,65.24 11.68,65.24 15.49,61.43 15.49,60.16 19.3,56.35 19.3,55.08 23.11,51.27 23.11,50 26.92,46.19 81.01,46.19 112.76,77.94 134.35,77.94 147.05,65.24 150.86,65.24 J2.B10
B15
  Bottom 0.406: J1.B15 9.14,52.54 11.68,52.54 26.92,37.3 133.08,37.3 148.32,52.54 150.86,52.54 J2.B15
B16
  Top 0.406: J1.B16 9.14,50 11.68,50 26.92,34.76 133.08,34.76 148.32,50 150.86,50 J2.B16
B17
  Bottom 0.406: J2.B17 150.86,47.46 147.05,47.46 133.08,33.49 26.92,33.49 12.95,47.46 9.14,47.46 J1.B17
B18
  Top 0.406: J2.B18 150.86,44.92 147.05,44.92 133.08,30.95 26.92,30.95 12.95,44.92 9.14,44.92 J1.B18
B19
  Bottom 0.406: J2.B19 150.86,42.38 145.78,42.38 133.08,29.68 26.92,29.68 14.22,42.38 9.14,42.38 J1.B19
B20
  Top 0.406: J2.B20 150.86,39.84 145.78,39.84 133.08,27.14 26.92,27.14 14.22,39.84 9.14,39.84 J1.B20
B21
  Bottom 0.406: J2.B21 150.86,37.3 144.51,37.3 133.08,25.87 26.92,25.87 15.49,37.3 9.14,37.3 J1.B21
B22
  Top 0.406: J2.B22 150.86,34.76 144.51,34.76 133.08,23.33 26.92,23.33 15.49,34.76 9.14,34.76 J1.B22
B23
  Bottom 0.406: J2.B23 150.86,32.22 143.24,32.22 133.08,22.06 26.92,22.06 16.76,32.22 9.14,32.22 J1.B23
B24
  Top 0.406: J2.B24 150.86,29.68 143.24,29.68 133.08,19.52 26.92,19.52 16.76,29.68 9.14,29.68 J1.B24
B25
  Bottom 0.406: J2.B25 150.86,27.14 141.97,27.14 133.08,18.25 26.92,18.25 18.03,27.14 9.14,27.14 J1.B25
B26
  Top 0.406: J2.B26 150.86,24.6 141.97,24.6 133.08,15.71 26.92,15.71 18.03,24.6 9.14,24.6 J1.B26
B27
  Bottom 0.406: J2.B27 150.86,22.06 140.7,22.06 133.08,14.44 26.92,14.44 19.3,22.06 9.14,22.06 J1.B27
B28
  Top 0.406: J2.B28 150.86,19.52 140.7,19.52 133.08,11.9 26.92,11.9 19.3,19.52 9.14,19.52 J1.B28
B29
  Bottom 0.406: J2.B29 150.86,16.98 139.43,16.98 133.08,10.63 26.92,10.63 20.57,16.98 9.14,16.98 J1.B29
B30
  Top 0.406: J1.B30 9.14,14.44 20.57,14.44 26.92,8.09 133.08,8.09 139.43,14.44 150.86,14.44 J2.B30
B31
  Bottom 0.406: J2.B31 150.86,11.9 138.16,11.9 133.08,6.82 26.92,6.82 21.84,11.9 9.14,11.9 J1.B31
B32
  Top 0.406: J1.B32 9.14,9.36 21.84,9.36 26.92,4.28 133.08,4.28 138.16,9.36 150.86,9.36 J2.B32
C10
  Bottom 0.406: J2.C10 148.32,66.51 129.27,47.46 26.92,47.46 21.84,52.54 21.84,53.81 18.03,57.62 18.03,58.89 14.22,62.7 14.22,63.97 11.68,66.51 J1.C10
C15
  Top 0.406: J1.C15 11.68,53.81 14.22,51.27 14.22,50 26.92,37.3 81.01,37.3 112.76,69.05 131.81,69.05 147.05,53.81 J2.C15
C16
  Bottom 0.406: J1.C16 11.68,51.27 26.92,36.03 133.08,36.03 148.32,51.27 J2.C16
C17
  Top 0.406: J2.C17 148.32,48.73 133.08,33.49 26.92,33.49 11.68,48.73 J1.C17
C18
  Bottom 0.406: J2.C18 147.05,46.19 133.08,32.22 26.92,32.22 12.95,46.19 J1.C18
C19
  Top 0.406: J2.C19 147.05,43.65 133.08,29.68 26.92,29.68 12.95,43.65 J1.C19
C20
  Bottom 0.406: J2.C20 145.78,41.11 133.08,28.41 26.92,28.41 14.22,41.11 J1.C20
C21
  Top 0.406: J2.C21 145.78,38.57 133.08,25.87 26.92,25.87 14.22,38.57 J1.C21
C22
  Bottom 0.406: J2.C22 144.51,36.03 133.08,24.6 26.92,24.6 15.49,36.03 J1.C22
C23
  Top 0.406: J2.C23 144.51,33.49 133.08,22.06 26.92,22.06 15.49,33.49 J1.C23
C24
  Bottom 0.406: J2.C24 143.24,30.95 133.08,20.79 26.92,20.79 16.76,30.95 J1.C24
C25
  Top 0.406: J2.C25 143.24,28.41 133.08,18.25 26.92,18.25 16.76,28.41 J1.C25
C26
  Bottom 0.406: J2.C26 141.97,25.87 133.08,16.98 26.92,16.98 18.03,25.87 J1.C26
C27
  Top 0.406: J2.C27 141.97,23.33 133.08,14.44 26.92,14.44 18.03,23.33 J1.C27
C28
  Bottom 0.406: J2.C28 140.7,20.79 133.08,13.17 26.92,13.17 19.3,20.79 J1.C28
C29
  Top 0.406: J2.C29 140.7,18.25 133.08,10.63 26.92,10.63 19.3,18.25 J1.C29
C30
  Bottom 0.406: J1.C30 20.57,15.71 26.92,9.36 133.08,9.36 139.43,15.71 J2.C30
C31
  Top 0.406: J2.C31 139.43,13.17 133.08,6.82 26.92,6.82 20.57,13.17 J1.C31
C32
  Bottom 0.406: J1.C32 21.84,10.63 26.92,5.55 133.08,5.55 138.16,10.63 J2.C32
CHARGE_PROBE_0
  Bottom 0.406: J1.A14 6.6,55.08 11.68,55.08 12.95,53.81 12.95,52.54 26.92,38.57 131.81,38.57 148.32,55.08 153.4,55.08 J2.A14
CHARGE_PROBE_1
  Top 0.406: J2.B14 150.86,55.08 147.05,55.08 131.81,70.32 112.76,70.32 81.01,38.57 26.92,38.57 15.49,50 15.49,51.27 11.68,55.08 9.14,55.08 J1.B14
CONDUCTIVITY_ENABLE
  Bottom 0.406: J1.C14 11.68,56.35 14.22,53.81 14.22,52.54 26.92,39.84 131.81,39.84 148.32,56.35 J2.C14
GND  (via drill 0.76, 1.3)
  Top 0.406: J1.B12 9.14,60.16 11.68,60.16 15.49,56.35 15.49,55.08 19.3,51.27 19.3,50 26.92,42.38 81.01,42.38 112.76,74.13 v114.03,74.13 133.08,74.13 147.05,60.16 150.86,60.16 J2.B12 | J2.A7 153.4,72.86 147.05,72.86 136.89,83.02 v114.03,83.02 112.76,83.02 81.01,51.27 28.19,51.27 24.38,55.08 24.38,56.35 20.57,60.16 20.57,61.43 16.76,65.24 16.76,66.51 12.95,70.32 12.95,71.59 11.68,72.86 6.6,72.86 J1.A7 | J2.A5 153.4,77.94 147.05,77.94 138.16,86.83 v114.03,86.83 112.76,86.83 81.01,55.08 29.46,55.08 24.38,60.16 24.38,61.43 20.57,65.24 20.57,66.51 16.76,70.32 16.76,71.59 12.95,75.4 12.95,76.67 11.68,77.94 6.6,77.94 J1.A5 | v112.76,65.24 v112.76,41.11 | v115.3,65.24 v115.3,44.92 | v117.84,65.24 v117.84,53.81 | v77.2,80.48 v77.2,77.94 | v77.2,77.94 v77.2,75.4 | v77.2,75.4 v77.2,72.86 | v77.2,72.86 v77.2,70.32 | v77.2,70.32 v77.2,67.78 v82.28,67.78 | v82.28,70.32 v77.2,70.32 | v82.28,72.86 v77.2,72.86 | v82.28,75.4 v77.2,75.4 | v82.28,77.94 v77.2,77.94 | v82.28,80.48 v77.2,80.48 | v77.2,80.48 v77.2,83.02 | C6.2 C5.2 C2.2 C1.2 42.91,80.48 41.64,81.75 | J2.B2 150.86,85.56 147.05,85.56 139.43,93.18 v120.38,93.18 112.76,93.18 81.01,61.43 30.73,61.43 26.92,65.24 26.92,66.51 23.11,70.32 23.11,71.59 19.3,75.4 19.3,76.67 15.49,80.48 15.49,81.75 11.68,85.56 9.14,85.56 J1.B2 | v120.38,65.24 v120.38,62.7 | v82.28,83.02 v77.2,83.02 | v77.2,85.56 v82.28,85.56 | v77.2,85.56 75.93,85.56 74.66,84.29 74.66,67.78 72.12,65.24 42.91,65.24 40.37,67.78 40.37,80.48 41.64,81.75 | IC1.1 36.56,86.83 37.83,88.1 39.1,86.83 39.1,84.29 41.64,81.75 | v77.2,85.56 v77.2,88.1 | v77.2,83.02 v77.2,85.56 | J1.C3 11.68,84.29 14.22,81.75 14.22,80.48 18.03,76.67 18.03,75.4 21.84,71.59 21.84,70.32 25.65,66.51 25.65,65.24 30.73,60.16 81.01,60.16 112.76,91.91 v116.57,91.91 139.43,91.91 147.05,84.29 J2.C3
  Top 0.406: IC2.2 C3.2 67.04,72.86 68.31,71.59 C4.2 72.12,71.59 73.39,72.86 73.39,85.56 75.93,88.1 v77.2,88.1 | v82.28,88.1 v77.2,88.1
  Bottom 0.406: J1.B13 9.14,57.62 11.68,57.62 15.49,53.81 15.49,52.54 26.92,41.11 v112.76,41.11 131.81,41.11 148.32,57.62 150.86,57.62 J2.B13 | J2.B11 150.86,62.7 148.32,62.7 130.54,44.92 v115.3,44.92 26.92,44.92 19.3,52.54 19.3,53.81 15.49,57.62 15.49,58.89 11.68,62.7 9.14,62.7 J1.B11 | J1.A6 6.6,75.4 11.68,75.4 12.95,74.13 12.95,72.86 16.76,69.05 16.76,67.78 20.57,63.97 20.57,62.7 24.38,58.89 24.38,57.62 28.19,53.81 v117.84,53.81 126.73,53.81 148.32,75.4 153.4,75.4 J2.A6 | v82.28,67.78 84.82,65.24 v112.76,65.24 | v82.28,70.32 86.09,66.51 114.03,66.51 v115.3,65.24 | v82.28,72.86 87.36,67.78 115.3,67.78 v117.84,65.24 | v82.28,75.4 88.63,69.05 107.68,69.05 112.76,74.13 v114.03,74.13 | v82.28,77.94 89.9,70.32 100.06,70.32 112.76,83.02 v114.03,83.02 | v82.28,80.48 91.17,71.59 97.52,71.59 112.76,86.83 v114.03,86.83 | J1.C2 11.68,86.83 14.22,84.29 14.22,83.02 18.03,79.21 18.03,77.94 21.84,74.13 21.84,72.86 25.65,69.05 25.65,67.78 30.73,62.7 v120.38,62.7 124.19,62.7 148.32,86.83 J2.C2 | v82.28,85.56 83.55,85.56 87.36,89.37 116.57,89.37 v120.38,93.18 | v82.28,83.02 83.55,83.02 88.63,88.1 115.3,88.1 120.38,83.02 v120.38,65.24 | v82.28,88.1 83.55,88.1 86.09,90.64 115.3,90.64 v116.57,91.91
  Bottom 0.813: U$6.- 18.45,83.34 25.13,76.67 38.1,76.67 39.37,75.4 39.37,69.05 43.18,65.24 75.93,65.24 77.2,66.51 v77.2,67.78 v77.2,70.32 v77.2,72.86 v77.2,75.4 v77.2,77.94 v77.2,80.48 v77.2,83.02 v77.2,85.56 v77.2,88.1
GND_5V_DIFF
  Top 0.406: J1.B8 9.14,70.32 11.68,70.32 15.49,66.51 15.49,65.24 19.3,61.43 19.3,60.16 23.11,56.35 23.11,55.08 28.19,50 81.01,50 112.76,81.75 135.62,81.75 147.05,70.32 150.86,70.32 J2.B8
GND_7V_DIFF
  Bottom 0.406: J2.B9 150.86,67.78 148.32,67.78 129.27,48.73 26.92,48.73 23.11,52.54 23.11,53.81 19.3,57.62 19.3,58.89 15.49,62.7 15.49,63.97 11.68,67.78 9.14,67.78 J1.B9
GND_TEMP
  Bottom 0.406: J1.B3 9.14,83.02 11.68,83.02 15.49,79.21 15.49,77.94 19.3,74.13 19.3,72.86 23.11,69.05 23.11,67.78 26.92,63.97 26.92,62.7 29.46,60.16 125.46,60.16 148.32,83.02 150.86,83.02 J2.B3
I_1_H
  Top 0.406: J1.C5 11.68,79.21 14.22,76.67 14.22,75.4 18.03,71.59 18.03,70.32 21.84,66.51 21.84,65.24 25.65,61.43 25.65,60.16 29.46,56.35 81.01,56.35 112.76,88.1 138.16,88.1 147.05,79.21 J2.C5
I_1_L
  Bottom 0.406: J1.B5 9.14,77.94 11.68,77.94 15.49,74.13 15.49,72.86 19.3,69.05 19.3,67.78 23.11,63.97 23.11,62.7 26.92,58.89 26.92,57.62 28.19,56.35 126.73,56.35 148.32,77.94 150.86,77.94 J2.B5
I_2_H
  Bottom 0.406: J2.C6 148.32,76.67 126.73,55.08 28.19,55.08 25.65,57.62 25.65,58.89 21.84,62.7 21.84,63.97 18.03,67.78 18.03,69.05 14.22,72.86 14.22,74.13 11.68,76.67 J1.C6
I_2_L
  Top 0.406: J2.B6 150.86,75.4 147.05,75.4 136.89,85.56 112.76,85.56 81.01,53.81 28.19,53.81 26.92,55.08 26.92,56.35 23.11,60.16 23.11,61.43 19.3,65.24 19.3,66.51 15.49,70.32 15.49,71.59 11.68,75.4 9.14,75.4 J1.B6
I_3_H
  Top 0.406: J1.C7 11.68,74.13 14.22,71.59 14.22,70.32 18.03,66.51 18.03,65.24 21.84,61.43 21.84,60.16 25.65,56.35 25.65,55.08 28.19,52.54 81.01,52.54 112.76,84.29 136.89,84.29 147.05,74.13 J2.C7
I_3_L
  Bottom 0.406: J2.B7 150.86,72.86 148.32,72.86 128,52.54 28.19,52.54 23.11,57.62 23.11,58.89 19.3,62.7 19.3,63.97 15.49,67.78 15.49,69.05 11.68,72.86 9.14,72.86 J1.B7
PROBE_DIFF_HOR
  Top 0.406: J1.A13 6.6,57.62 11.68,57.62 12.95,56.35 12.95,55.08 16.76,51.27 16.76,50 26.92,39.84 81.01,39.84 112.76,71.59 133.08,71.59 147.05,57.62 153.4,57.62 J2.A13
PROBE_DIFF_VERT
  Top 0.406: J1.C13 11.68,58.89 14.22,56.35 14.22,55.08 18.03,51.27 18.03,50 26.92,41.11 81.01,41.11 112.76,72.86 133.08,72.86 147.05,58.89 J2.C13
PROBE_HOR_1_RIGHT
  Top 0.406: J1.A11 6.6,62.7 11.68,62.7 12.95,61.43 12.95,60.16 16.76,56.35 16.76,55.08 20.57,51.27 20.57,50 26.92,43.65 81.01,43.65 112.76,75.4 134.35,75.4 147.05,62.7 153.4,62.7 J2.A11
PROBE_HOR_2_LEFT
  Bottom 0.406: J1.A12 6.6,60.16 11.68,60.16 12.95,58.89 12.95,57.62 16.76,53.81 16.76,52.54 26.92,42.38 130.54,42.38 148.32,60.16 153.4,60.16 J2.A12
PROBE_VERT_1_UP
  Top 0.406: J1.C11 11.68,63.97 14.22,61.43 14.22,60.16 18.03,56.35 18.03,55.08 21.84,51.27 21.84,50 26.92,44.92 81.01,44.92 112.76,76.67 134.35,76.67 147.05,63.97 J2.C11
PROBE_VERT_2_DOWN
  Bottom 0.406: J2.C12 148.32,61.43 130.54,43.65 26.92,43.65 18.03,52.54 18.03,53.81 14.22,57.62 14.22,58.89 11.68,61.43 J1.C12
TEMP_1
  Top 0.406: J2.B4 150.86,80.48 147.05,80.48 138.16,89.37 112.76,89.37 81.01,57.62 29.46,57.62 26.92,60.16 26.92,61.43 23.11,65.24 23.11,66.51 19.3,70.32 19.3,71.59 15.49,75.4 15.49,76.67 11.68,80.48 9.14,80.48 J1.B4
TEMP_2
  Bottom 0.406: J2.A4 153.4,80.48 148.32,80.48 125.46,57.62 29.46,57.62 24.38,62.7 24.38,63.97 20.57,67.78 20.57,69.05 16.76,72.86 16.76,74.13 12.95,77.94 12.95,79.21 11.68,80.48 6.6,80.48 J1.A4
TEMP_3
  Top 0.406: J2.A3 153.4,83.02 147.05,83.02 139.43,90.64 112.76,90.64 81.01,58.89 29.46,58.89 28.19,60.16 28.19,61.43 24.38,65.24 24.38,66.51 20.57,70.32 20.57,71.59 16.76,75.4 16.76,76.67 12.95,80.48 12.95,81.75 11.68,83.02 6.6,83.02 J1.A3
VIN
  Top 0.406: IC2.1 61.96,70.32 C3.1 | IC1.3 31.48,88.1 34.02,90.64 41.64,90.64 44.18,88.1 C1.1
  Bottom 0.813: U$6.+ 25.45,82.69 27.67,80.48 28.94,80.48 31.48,83.02 | IC1.3 31.48,83.02 | IC2.1 49.26,70.32 47.99,69.05 43.18,69.05 41.91,70.32 41.91,77.94 39.37,80.48 34.02,80.48 31.48,83.02

### Text on the board
tPlace: GLOBAL ELECTRIC CIRCUIT / DEBUG POWER SUPPLY BOARD REV 1.0 / C. ANDERSON / 7/30/19 / NorthWest Research Associates / DigiPen Institute of Technology | +3V3 -- C1 | +3V3 -- B1 | +5V -- C4 | GND_5V -- C3 | GND_3V3 -- B2 | GND_3V3 -- C2 | GND -- A5 | GND -- A7 | GND -- B12 | GND -- A6 | GND -- B11 | GND -- B13